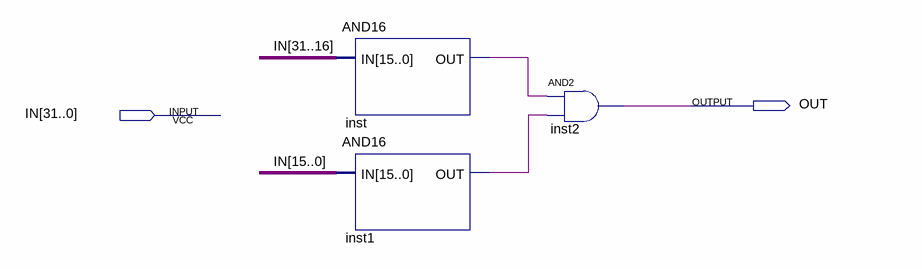
[diagram p0: schematic sheet]
// Quartus schematic AND32.bdf as structural Verilog: 3 symbols, 2 pins
module AND32 (
  input  [31:0] IN,
  output OUT
);

  wire inst1_out, inst_out;

  AND16 inst (.IN(IN[31:16]), .OUT(inst_out));
  AND16 inst1 (.IN(IN[15:0]), .OUT(inst1_out));
  and inst2 (OUT, inst_out, inst1_out);
endmodule
